# Altium project Program_Interface.PrjPcb
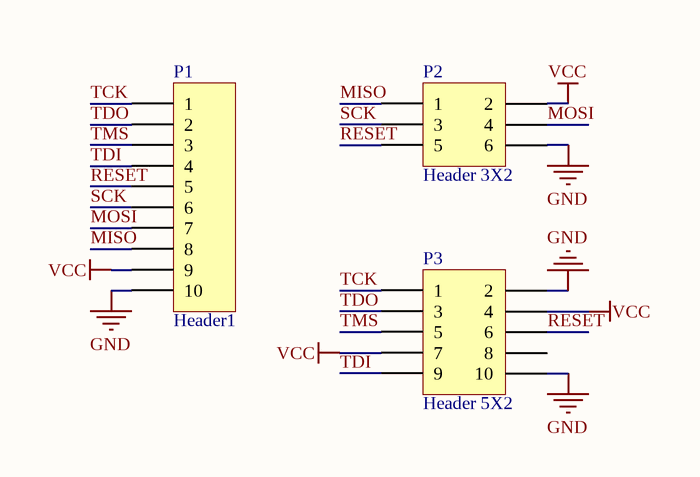
[diagram p0: Program_Interface.SchDoc]
1 sheet, 3 parts. Net scope: global (net labels, ports and power ports of the same name join across sheets).
Board file: Program_Iterface.PcbDoc

## Sheet Program_Interface.SchDoc
size A4

### Parts
P1  Header1  [HDR1X10H]
P2  Header 3X2  [HDR2X3]
P3  Header 5X2  [HDR2X5]

### Nets
GND: P1.10 P2.6 P3.2 P3.10
VCC: P1.9 P2.2 P3.4 P3.7
MISO: P1.8 P2.1
MOSI: P1.7 P2.4
RESET: P1.5 P2.5 P3.6
SCK: P1.6 P2.3
TCK: P1.1 P3.1
TDI: P1.4 P3.9
TDO: P1.2 P3.3
TMS: P1.3 P3.5

Not connected (* = marked no-connect by the designer): P3 8

### Library data of the parts
P1 = Header 10: Header, 10-Pin; LatestRevisionDate: 17-Jul-2002; LatestRevisionNote: Re-released for DXP Platform.; Publisher: Altium Limited
P2 = Header 3X2: Header, 3-Pin, Dual row; LatestRevisionDate: 17-Jul-2002; LatestRevisionNote: Re-released for DXP Platform.; Publisher: Altium Limited
P3 = Header 5X2: Header, 5-Pin, Dual row; LatestRevisionDate: 17-Jul-2002; LatestRevisionNote: Re-released for DXP Platform.; Publisher: Altium Limited